# EAGLE schematic MainECU rev9 (EAGLE 9.5.0)

## Sheet 1 of 4: Inputs/Outputs and Power
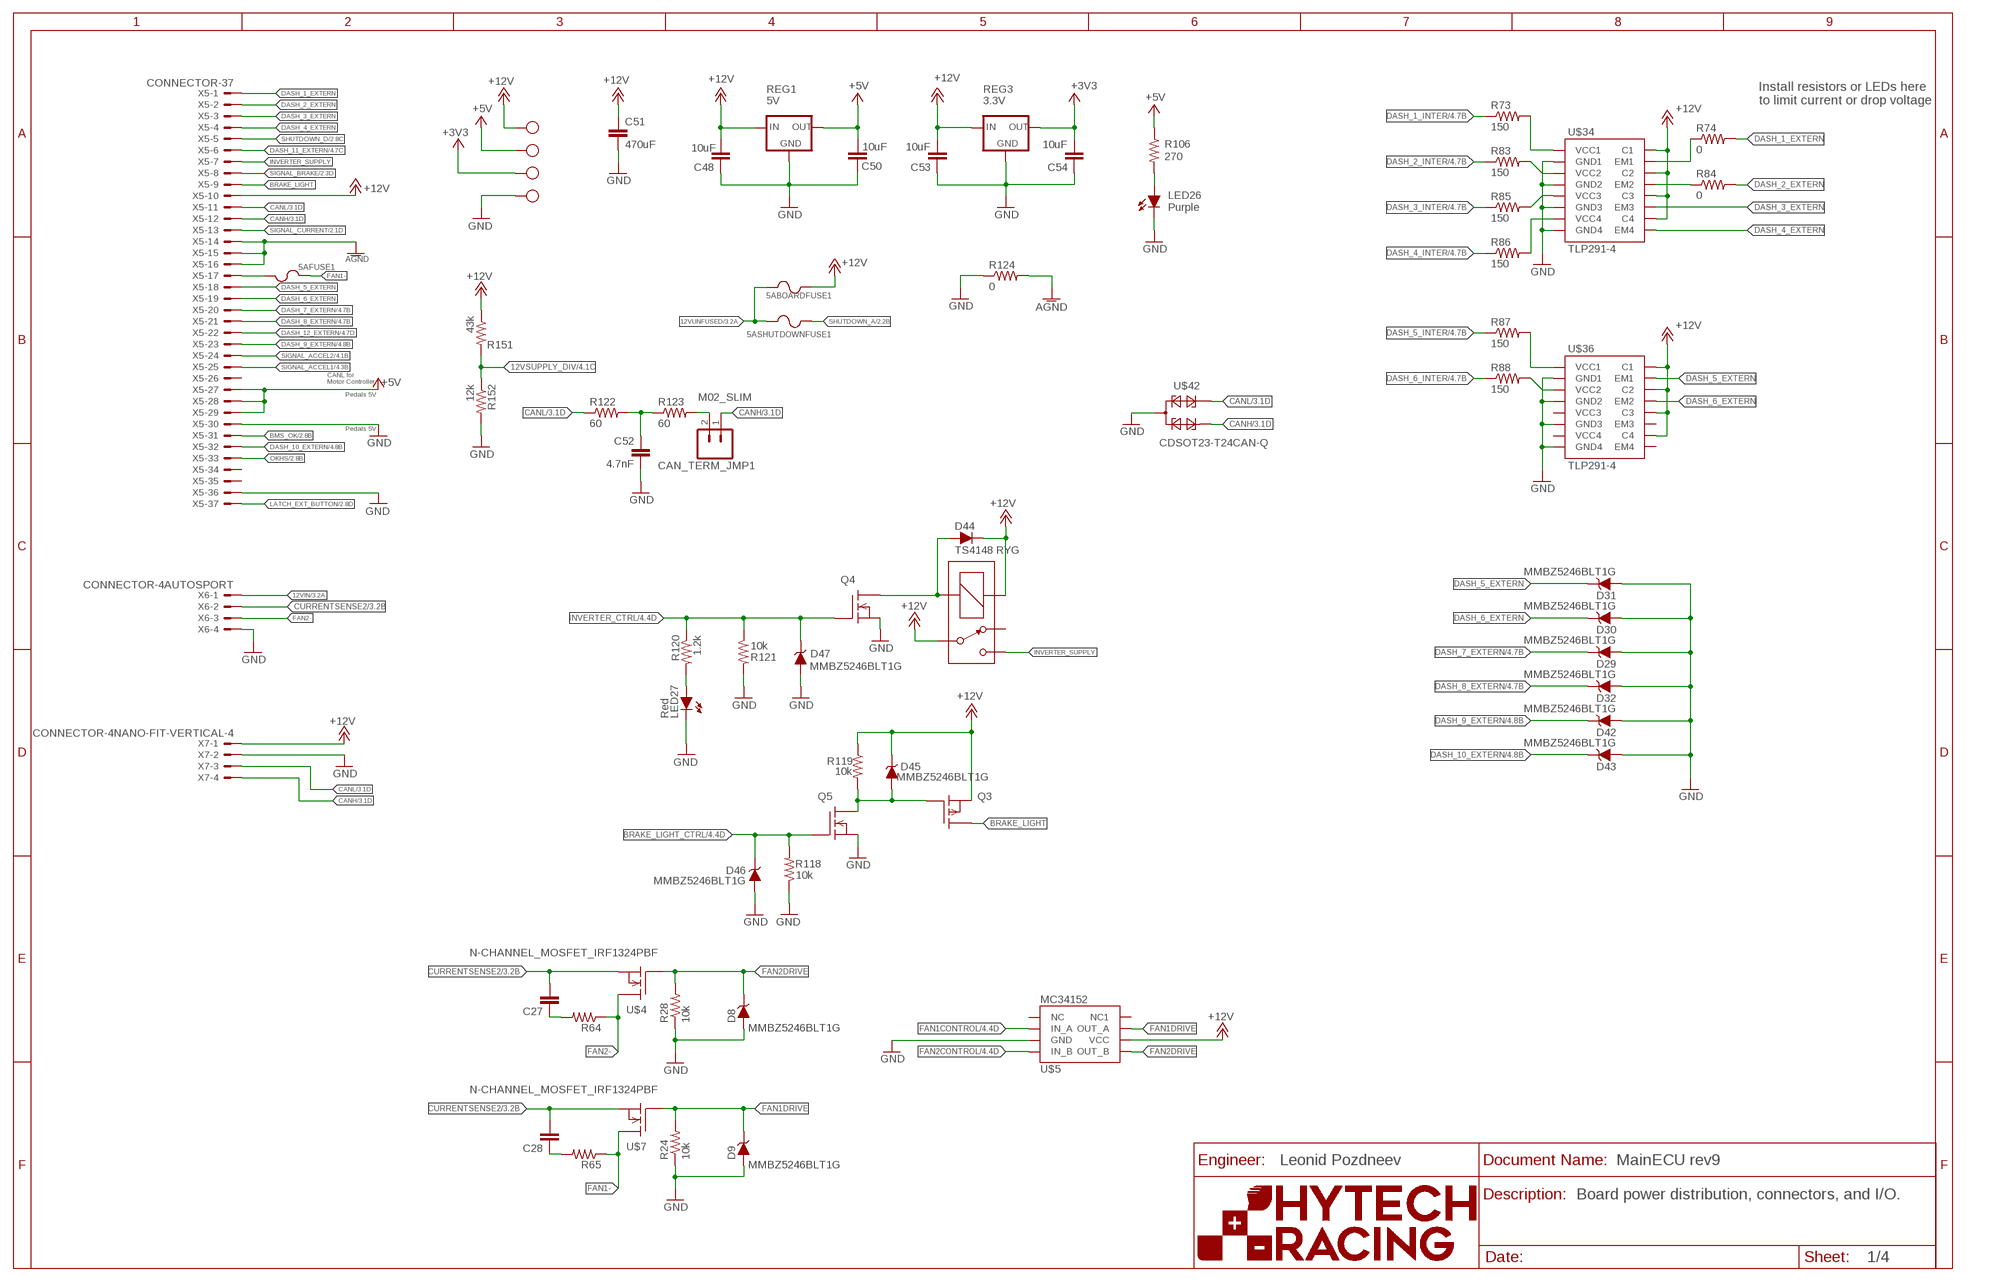
[diagram p0: schematic, sheet 1]
U$1 (FRAME_B_L): ORIENTATION: LANDSCAPE; SIZE: B

### Parts
3V3_TEST  TEST_POINT  [TEST_POINT]
5ABOARDFUSE1  FUSE_MINIBLADE  [MINI-BLADE_FUSE_HOLDER]
5AFUSE1  FUSE_MINIBLADE  [MINI-BLADE_FUSE_HOLDER]
5ASHUTDOWNFUSE1  FUSE_MINIBLADE  [MINI-BLADE_FUSE_HOLDER]
C  12V_TEST  TEST_POINT  [TEST_POINT]
C27  CAP0603-CAP  [0603-CAP]
C28  CAP0603-CAP  [0603-CAP]
C48  10uF  CAP0603-CAP  [0603-CAP]
C50  10uF  CAP0603-CAP  [0603-CAP]
C51  470uF  CAPPTH3  [CAP-PTH-LARGE]
C52  4.7nF  CAP0603-CAP  [0603-CAP]
C53  10uF  CAP0603-CAP  [0603-CAP]
C54  10uF  CAP0603-CAP  [0603-CAP]
CAN_TERM_JMP1  M02_SLIM  [1X02_SLIM]
D8  MMBZ5246BLT1G  DIODE_ZENER  [SOT23]
D9  MMBZ5246BLT1G  DIODE_ZENER  [SOT23]
D29  MMBZ5246BLT1G  DIODE_ZENER  [SOT23]
D30  MMBZ5246BLT1G  DIODE_ZENER  [SOT23]
D31  MMBZ5246BLT1G  DIODE_ZENER  [SOT23]
D32  MMBZ5246BLT1G  DIODE_ZENER  [SOT23]
D42  MMBZ5246BLT1G  DIODE_ZENER  [SOT23]
D43  MMBZ5246BLT1G  DIODE_ZENER  [SOT23]
D44  TS4148 RYG  DIODE0805  [0805_D]
D45  MMBZ5246BLT1G  DIODE_ZENER  [SOT23]
D46  MMBZ5246BLT1G  DIODE_ZENER  [SOT23]
D47  MMBZ5246BLT1G  DIODE_ZENER  [SOT23]
INVERTER_PWR_RELAY1  G5LE  [ZF112]
LED26  Purple  LED-0805  [LED-805]
LED27  Red  LED-0805  [LED-805]
Q3  P-CHANNEL_MOSFET_DMP3099L-7  [SOT23]
Q4  DMG3406LSOT  [SOT23]
Q5  DMG3406LSOT  [SOT23]
R24  10k  RESISTOR0603  [0603-RES]
R28  10k  RESISTOR0603  [0603-RES]
R64  RESISTOR0603  [0603-RES]
R65  RESISTOR0603  [0603-RES]
R73  150  RESISTOR0603  [0603-RES]
R74  0  RESISTOR0603  [0603-RES]
R83  150  RESISTOR0603  [0603-RES]
R84  0  RESISTOR0603  [0603-RES]
R85  150  RESISTOR0603  [0603-RES]
R86  150  RESISTOR0603  [0603-RES]
R87  150  RESISTOR0603  [0603-RES]
R88  150  RESISTOR0603  [0603-RES]
R106  270  RESISTOR0603  [0603-RES]
R118  10k  RESISTOR0603  [0603-RES]
R119  10k  RESISTOR0603  [0603-RES]
R120  1.2k  RESISTOR0603  [0603-RES]
R121  10k  RESISTOR0603  [0603-RES]
R122  60  RESISTOR0603  [0603-RES]
R123  60  RESISTOR0603  [0603-RES]
R124  0  RESISTOR0603  [0603-RES]
R151  43k  RESISTOR0603  [0603-RES]
R152  12k  RESISTOR0603  [0603-RES]
REG1  5V  OKI-78SR-5  [OKI-78SR]
REG3  3.3V  OKI-78SR-3.3  [OKI-78SR]
U$4  N-CHANNEL_MOSFET_IRF1324PBF  N-CHANNEL_MOSFET_HOR_HOLE  [TO-220-H-HOLE]
U$5  MC34152  [SOIC-08]
U$7  N-CHANNEL_MOSFET_IRF1324PBF  N-CHANNEL_MOSFET_HOR_HOLE  [TO-220-H-HOLE]
U$15  TEST_POINT  [TEST_POINT]
U$19  TEST_POINT  [TEST_POINT]
U$34  TLP291-4  [11-11F1]
U$36  TLP291-4  [11-11F1]
U$42  CDSOT23-T24CAN-Q  [SOT23]
X5  CONNECTOR-37  [AUTOSPORT_14-35]
X6  CONNECTOR-4AUTOSPORT  [AUTOSPORT_12-04]
X7  CONNECTOR-4NANO-FIT-VERTICAL-4  [NANO-FIT_VERTICAL-4]

### Nets
12VIN: X6.P$1 ; also sheet 3
12VSUPPLY_DIV: R151.2 R152.1 ; also sheet 4
12VUNFUSED: 5ABOARDFUSE1.L1 5ABOARDFUSE1.L2 5ASHUTDOWNFUSE1.L1 5ASHUTDOWNFUSE1.L2 ; also sheet 3
+3V3: 3V3_TEST.P$1 C54.2 REG3.3(OUT) ; also sheet 3,4
+5V: C50.2 R106.1 REG1.3(OUT) U$15.P$1 X5.P$27 X5.P$28 X5.P$29 ; also sheet 2,3,4
+12V: 5ABOARDFUSE1.R1 5ABOARDFUSE1.R2 C48.2 C51.1 C53.2 C.P$1 D44.C D45.3(C) INVERTER_PWR_RELAY1.1(COIL+) INVERTER_PWR_RELAY1.P Q3.2(S) R119.1 R151.1 REG1.1(IN) REG3.1(IN) U$5.6(VCC) U$34.10(C4) U$34.12(C3) U$34.14(C2) U$34.16(C1) U$36.10(C4) U$36.12(C3) U$36.14(C2) U$36.16(C1) X5.P$10 X7.P$1 ; also sheet 2
AGND: R124.2 X5.P$14 X5.P$15 X5.P$16 ; also sheet 3,4
BMS_OK: X5.P$31 ; also sheet 2,4
BRAKE_LIGHT: Q3.3(D) X5.P$9
BRAKE_LIGHT_CTRL: D46.3(C) Q5.1(G) R118.2 ; also sheet 4
CANH: CAN_TERM_JMP1.1 U$42.2 X5.P$12 X7.P$4 ; also sheet 3,4
CANL: R122.1 U$42.1 X5.P$11 X7.P$3 ; also sheet 3,4
CURRENTSENSE2: C27.2 C28.2 U$4.3(S) U$7.3(S) X6.P$2 ; also sheet 3
DASH_1_EXTERN: R74.2 X5.P$1
DASH_1_INTER: R73.1 ; also sheet 4
DASH_2_EXTERN: R84.2 X5.P$2
DASH_2_INTER: R83.1 ; also sheet 4
DASH_3_EXTERN: U$34.11(EM3) X5.P$3
DASH_3_INTER: R85.1 ; also sheet 4
DASH_4_EXTERN: U$34.9(EM4) X5.P$4
DASH_4_INTER: R86.1 ; also sheet 4
DASH_5_EXTERN: D31.3(C) U$36.15(EM1) X5.P$18
DASH_5_INTER: R87.1 ; also sheet 4
DASH_6_EXTERN: D30.3(C) U$36.13(EM2) X5.P$19
DASH_6_INTER: R88.1 ; also sheet 4
DASH_7_EXTERN: D29.3(C) X5.P$20 ; also sheet 4
DASH_8_EXTERN: D32.3(C) X5.P$21 ; also sheet 4
DASH_9_EXTERN: D42.3(C) X5.P$23 ; also sheet 4
DASH_10_EXTERN: D43.3(C) X5.P$32 ; also sheet 4
DASH_11_EXTERN: X5.P$6 ; also sheet 4
DASH_12_EXTERN: X5.P$22 ; also sheet 4
FAN1-: 5AFUSE1.R1 5AFUSE1.R2 R65.1 U$7.2(D)
FAN1CONTROL: U$5.2(IN_A) ; also sheet 4
FAN1DRIVE: D9.3(C) R24.2 U$5.7(OUT_A) U$7.1(G)
FAN2-: R64.1 U$4.2(D) X6.P$3
FAN2CONTROL: U$5.4(IN_B) ; also sheet 4
FAN2DRIVE: D8.3(C) R28.2 U$4.1(G) U$5.5(OUT_B)
GND: C48.1 C50.1 C51.2 C52.2 C53.1 C54.1 D8.1(A) D9.1(A) D29.1(A) D30.1(A) D31.1(A) D32.1(A) D42.1(A) D43.1(A) D46.1(A) D47.1(A) LED26.C LED27.C Q4.2(S) Q5.2(S) R24.1 R28.1 R118.1 R121.2 R124.1 R152.2 REG1.2(GND) REG3.2(GND) U$5.3(GND) U$19.P$1 U$34.2(GND1) U$34.4(GND2) U$34.6(GND3) U$34.8(GND4) U$36.2(GND1) U$36.4(GND2) U$36.6(GND3) U$36.8(GND4) U$42.3 X5.P$30 X5.P$36 X6.P$4 X7.P$2 ; also sheet 2,3,4
INVERTER_CTRL: D47.3(C) Q4.1(G) R120.1 R121.1 ; also sheet 4
INVERTER_SUPPLY: INVERTER_PWR_RELAY1.S X5.P$7
LATCH_EXT_BUTTON: X5.P$37 ; also sheet 2
N$65: C27.1 R64.2
N$70: 5AFUSE1.L1 5AFUSE1.L2 X5.P$17
N$74: C28.1 R65.2
N$84: R73.2 U$34.1(VCC1)
N$87: R74.1 U$34.15(EM1)
N$89: R83.2 U$34.3(VCC2)
N$90: R84.1 U$34.13(EM2)
N$91: R85.2 U$34.5(VCC3)
N$92: R86.2 U$34.7(VCC4)
N$93: R87.2 U$36.1(VCC1)
N$94: R88.2 U$36.3(VCC2)
N$113: LED26.A R106.2
N$114: D45.1(A) Q3.1(G) Q5.3(D) R119.2
N$116: LED27.A R120.2
N$117: D44.A INVERTER_PWR_RELAY1.2(COIL-) Q4.3(D)
N$118: CAN_TERM_JMP1.2 R123.2
N$119: C52.1 R122.2 R123.1
OKHS: X5.P$33 ; also sheet 2,4
SHUTDOWN_A: 5ASHUTDOWNFUSE1.R1 5ASHUTDOWNFUSE1.R2 ; also sheet 2
SHUTDOWN_D: X5.P$5 ; also sheet 2,4
SIGNAL_ACCEL1: X5.P$25 ; also sheet 4
SIGNAL_ACCEL2: X5.P$24 ; also sheet 4
SIGNAL_BRAKE: X5.P$8 ; also sheet 2,4
SIGNAL_CURRENT: X5.P$13 ; also sheet 2
Unconnected: INVERTER_PWR_RELAY1.O U$5.1(NC) U$5.8(NC1) U$36.5(VCC3) U$36.7(VCC4) U$36.9(EM4) U$36.11(EM3) X5.P$26 X5.P$34 X5.P$35

### Notes on the sheet
- Install resistors or LEDs here
  to limit current or drop voltage
- CANL for
  Motor Controller
- Pedals 5V
- Pedals 5V
- Leonid Pozdneev
- Board power distribution, connectors, and I/O.

## Sheet 2 of 4: Shutdown Circuitry
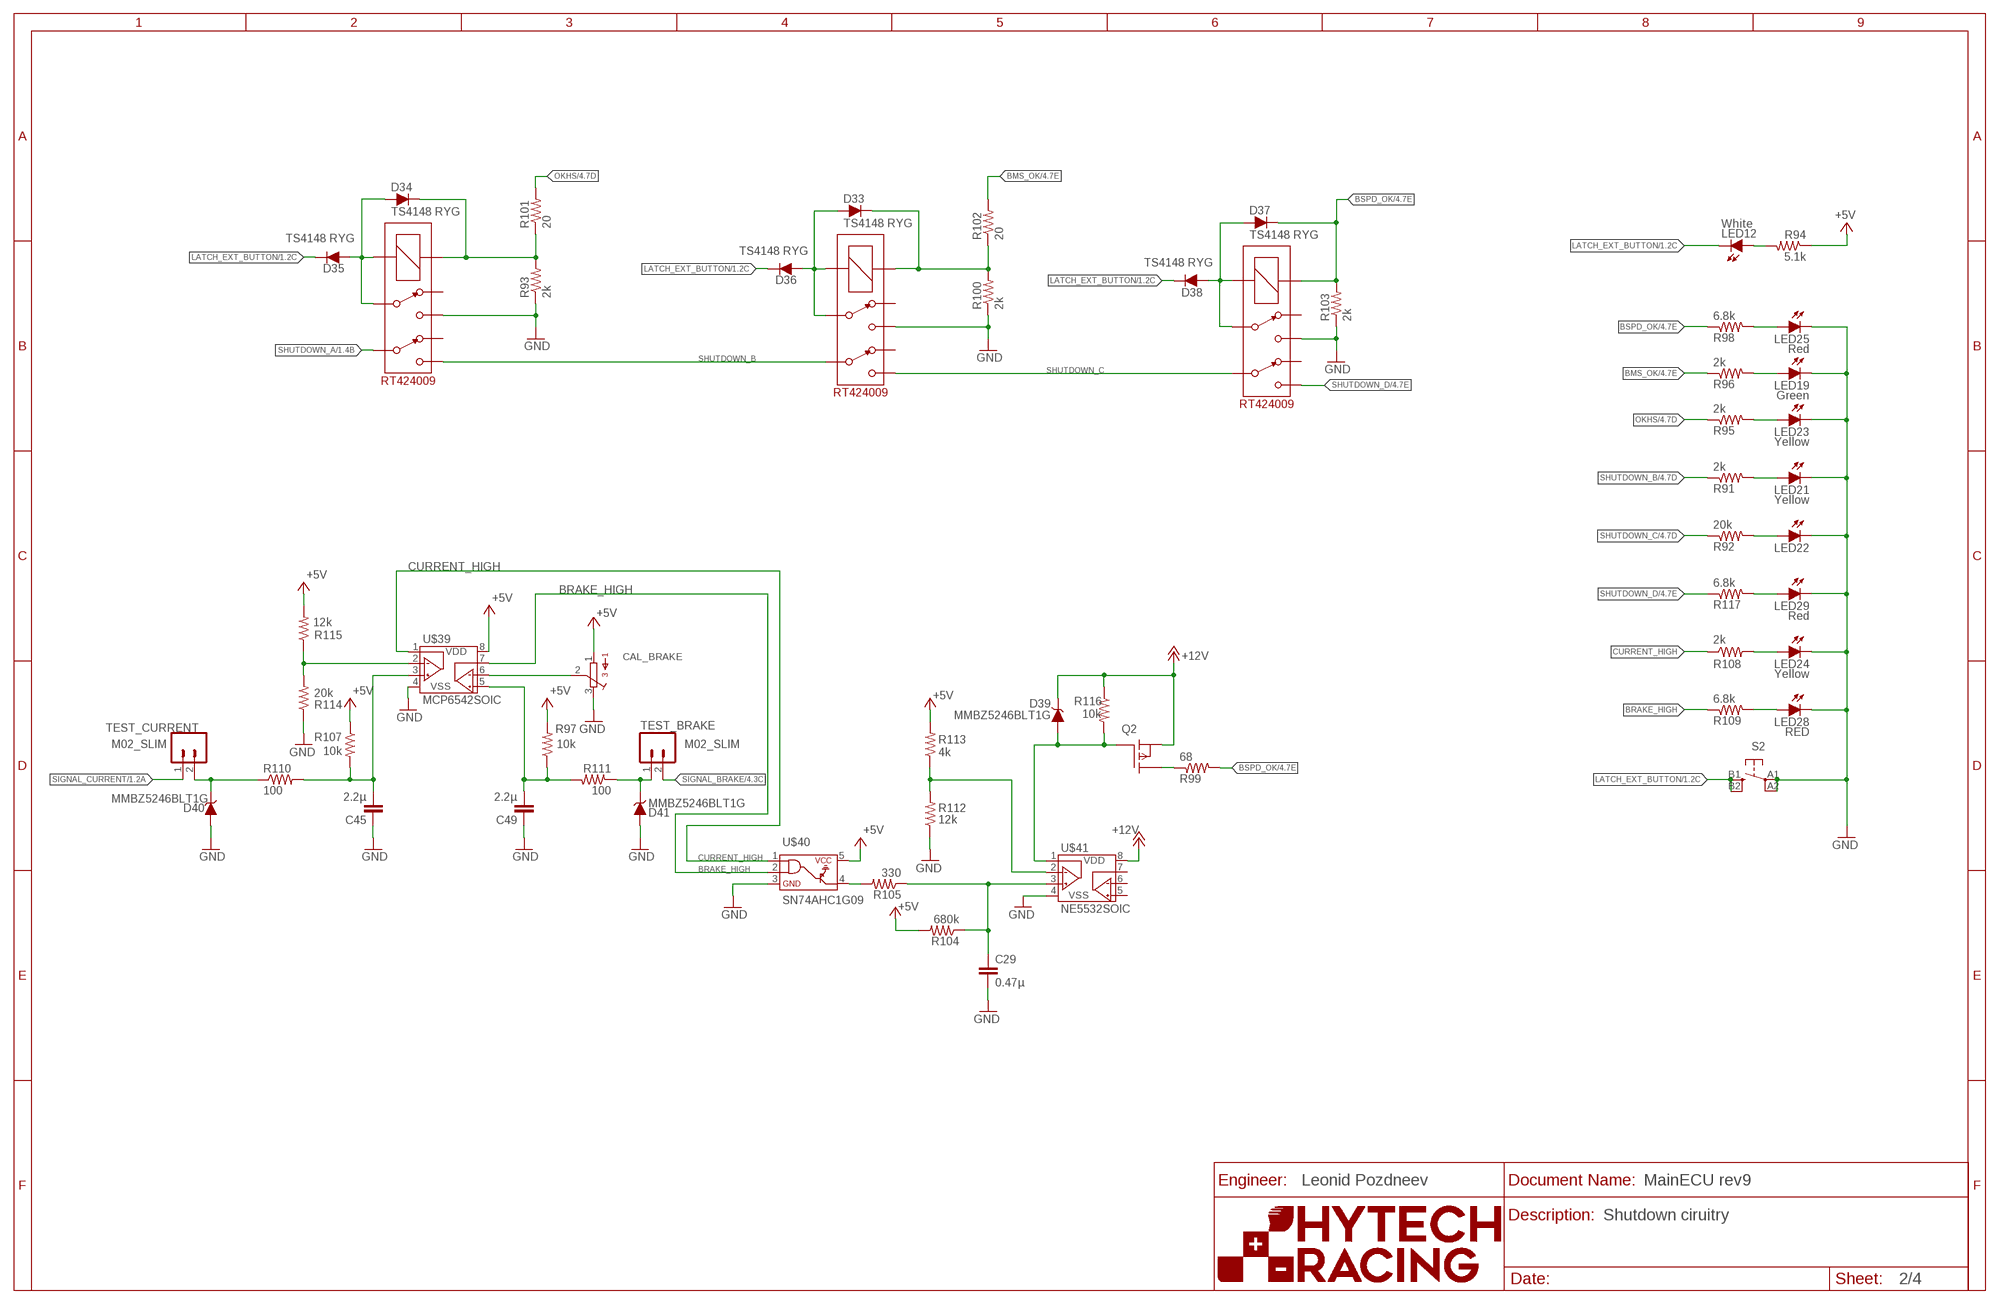
[diagram p1: schematic, sheet 2]
U$2 (FRAME_B_L): ORIENTATION: LANDSCAPE; SIZE: B

### Parts
C29  0.47µ  CAP0603-CAP  [0603-CAP]
C45  2.2µ  CAP0603-CAP  [0603-CAP]
C49  2.2µ  CAP0603-CAP  [0603-CAP]
CAL_BRAKE  TRIMPOT_3296C  [TRIMPOT_3296]
D33  TS4148 RYG  DIODE0805  [0805_D]
D34  TS4148 RYG  DIODE0805  [0805_D]
D35  TS4148 RYG  DIODE0805  [0805_D]
D36  TS4148 RYG  DIODE0805  [0805_D]
D37  TS4148 RYG  DIODE0805  [0805_D]
D38  TS4148 RYG  DIODE0805  [0805_D]
D39  MMBZ5246BLT1G  DIODE_ZENER  [SOT23]
D40  MMBZ5246BLT1G  DIODE_ZENER  [SOT23]
D41  MMBZ5246BLT1G  DIODE_ZENER  [SOT23]
IMD_SHUTDOWN_RLY1  RT424009  [RELAY_DPDT]
LED12  White  LED-0805  [LED-805]
LED19  Green  LED-0805  [LED-805]
LED21  Yellow  LED-0805  [LED-805]
LED22  Green  LED-0805  [LED-805]
LED23  Yellow  LED-0805  [LED-805]
LED24  Yellow  LED-0805  [LED-805]
LED25  Red  LED-0805  [LED-805]
LED28  RED  LED-0805  [LED-805]
LED29  Red  LED-0805  [LED-805]
Q2  P-CHANNEL_MOSFET_DMP3099L-7  [SOT23]
R91  2k  RESISTOR0603  [0603-RES]
R92  20k  RESISTOR0603  [0603-RES]
R93  2k  RESISTOR0603  [0603-RES]
R94  5.1k  RESISTOR0603  [0603-RES]
R95  2k  RESISTOR0603  [0603-RES]
R96  2k  RESISTOR0603  [0603-RES]
R97  10k  RESISTOR0603  [0603-RES]
R98  6.8k  RESISTOR0603  [0603-RES]
R99  68  RESISTOR0603  [0603-RES]
R100  2k  RESISTOR0603  [0603-RES]
R101  20  RESISTOR0603  [0603-RES]
R102  20  RESISTOR0603  [0603-RES]
R103  2k  RESISTOR0603  [0603-RES]
R104  680k  RESISTOR0603  [0603-RES]
R105  330  RESISTOR0603  [0603-RES]
R107  10k  RESISTOR0603  [0603-RES]
R108  2k  RESISTOR0603  [0603-RES]
R109  6.8k  RESISTOR0603  [0603-RES]
R110  100  RESISTOR0603  [0603-RES]
R111  100  RESISTOR0603  [0603-RES]
R112  12k  RESISTOR0603  [0603-RES]
R113  4k  RESISTOR0603  [0603-RES]
R114  20k  RESISTOR0603  [0603-RES]
R115  12k  RESISTOR0603  [0603-RES]
R116  10k  RESISTOR0603  [0603-RES]
R117  6.8k  RESISTOR0603  [0603-RES]
S2  BTN_10-XXSMD  [TACTILE_SWITCH_SMD_6.2MM_TALL]
TEST_BRAKE  M02_SLIM  [1X02_SLIM]
TEST_CURRENT  M02_SLIM  [1X02_SLIM]
U$37  RT424009  [RELAY_DPDT]
U$38  RT424009  [RELAY_DPDT]
U$39  MCP6542SOIC  [SOIC-08]
U$40  SN74AHC1G09  [SOT-23-5]
U$41  NE5532SOIC  [SOIC-08]

### Nets
+5V: CAL_BRAKE.1 R94.1 R97.2 R104.2 R107.1 R113.2 R115.2 U$39.8(VDD) U$40.5 ; also sheet 1,3,4
+12V: D39.3(C) Q2.2(S) R116.1 U$41.8(VDD) ; also sheet 1
BMS_OK: R96.1 R102.2 ; also sheet 1,4
BMS_PWR_STEP1: D33.A D36.A U$38.3 U$38.COIL-
BRAKE_HIGH: R109.1 U$39.7(VOUTB) U$40.2
BSPD_OK: D37.C R98.1 R99.2 R103.2 U$37.COIL+ ; also sheet 4
CURRENT_HIGH: R108.1 U$39.1(VOUTA) U$40.1
GND: C29.2 C45.1 C49.1 CAL_BRAKE.3 D40.1(A) D41.1(A) IMD_SHUTDOWN_RLY1.4 LED19.C LED21.C LED22.C LED23.C LED24.C LED25.C LED28.C LED29.C R93.1 R100.1 R103.1 R112.1 R114.1 S2.A1(P) S2.A2(P1) U$37.4 U$38.4 U$39.4(VSS) U$40.3 U$41.4(VSS) ; also sheet 1,3,4
IMD_PWR_STEP1: D34.A D35.A IMD_SHUTDOWN_RLY1.3 IMD_SHUTDOWN_RLY1.COIL-
LATCH_EXT_BUTTON: D35.C D36.C D38.C LED12.C S2.B1(S) S2.B2(S1) ; also sheet 1
N$1: Q2.3(D) R99.1
N$3: D34.C IMD_SHUTDOWN_RLY1.COIL+ R93.2 R101.1
N$4: D33.C R100.2 R102.1 U$38.COIL+
N$5: D40.3(C) R110.1 TEST_CURRENT.2
N$6: D41.3(C) R111.1 TEST_BRAKE.1
N$97: LED21.A R91.2
N$98: LED22.A R92.2
N$99: LED12.A R94.2
N$100: LED23.A R95.2
N$101: LED19.A R96.2
N$102: LED24.A R108.2
N$103: LED28.A R109.2
N$104: R114.2 R115.1 U$39.2(VINA-)
N$105: D37.A D38.A U$37.3 U$37.COIL-
N$106: C45.2 R107.2 R110.2 U$39.3(VINA+)
N$107: R105.2 U$40.4
N$108: LED25.A R98.2
N$109: C29.1 R104.1 R105.1 U$41.3(VINA+)
N$110: R112.2 R113.1 U$41.2(VINA-)
N$111: CAL_BRAKE.2 U$39.6(VINB-)
N$112: D39.1(A) Q2.1(G) R116.2 U$41.1(VOUTA)
N$115: LED29.A R117.2
OKHS: R95.1 R101.2 ; also sheet 1,4
SHUTDOWN_A: IMD_SHUTDOWN_RLY1.6 ; also sheet 1
SHUTDOWN_B: IMD_SHUTDOWN_RLY1.5 R91.1 U$38.6 ; also sheet 4
SHUTDOWN_C: R92.1 U$37.6 U$38.5 ; also sheet 4
SHUTDOWN_D: R117.1 U$37.5 ; also sheet 1,4
SIGNAL_BRAKE: TEST_BRAKE.2 ; also sheet 1,4
SIGNAL_BRAKE_FILT1: C49.2 R97.1 R111.2 U$39.5(VINB+)
SIGNAL_CURRENT: TEST_CURRENT.1 ; also sheet 1
Unconnected: IMD_SHUTDOWN_RLY1.2 IMD_SHUTDOWN_RLY1.7 U$37.2 U$37.7 U$38.2 U$38.7 U$41.5(VINB+) U$41.6(VINB-) U$41.7(VOUTB)

### Notes on the sheet
- Leonid Pozdneev
- Shutdown ciruitry

## Sheet 3 of 4: Telemetry
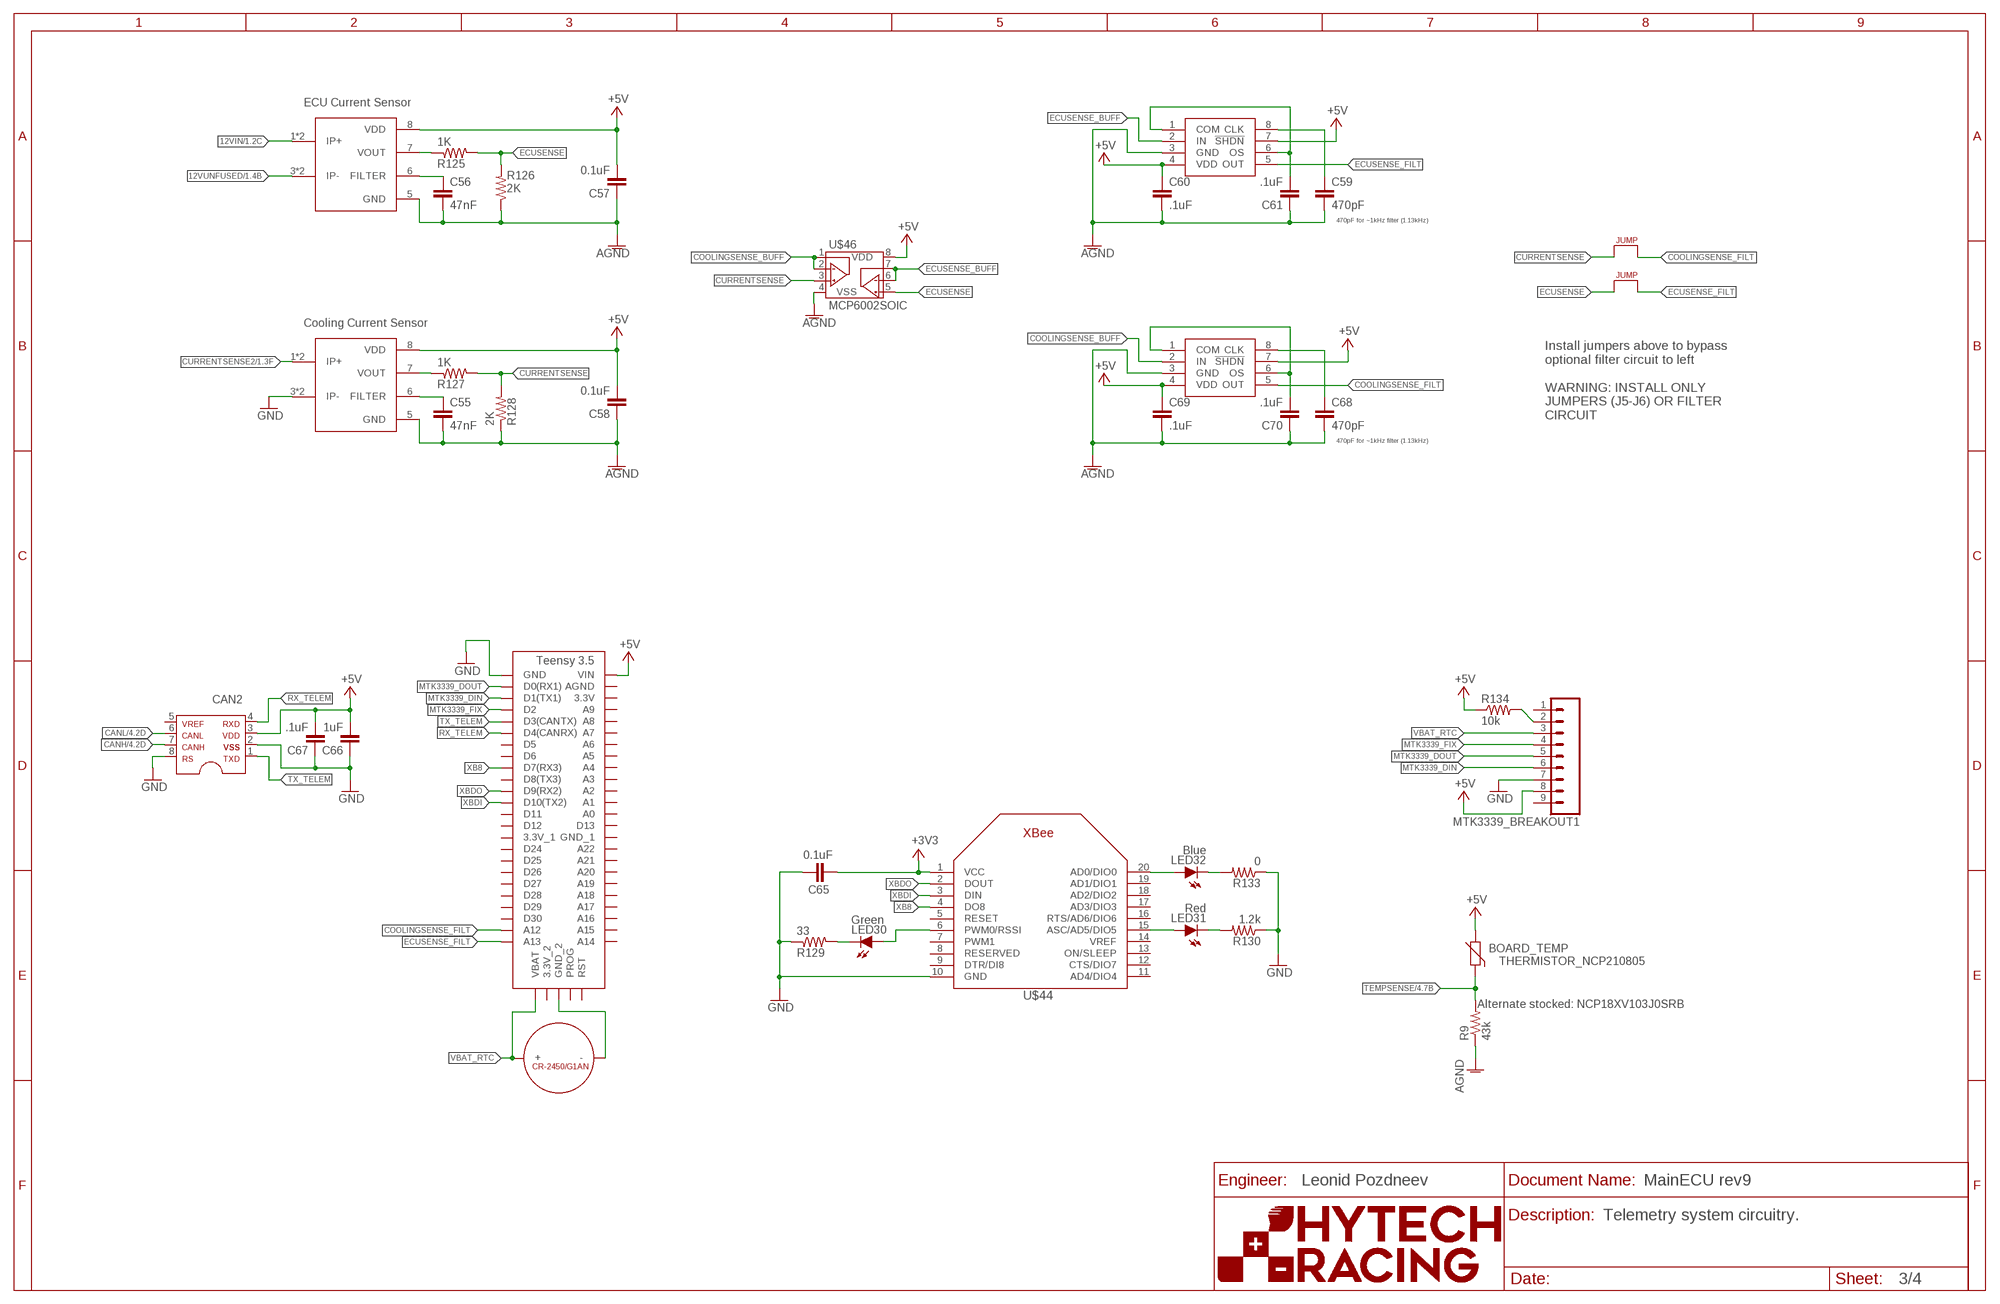
[diagram p2: schematic, sheet 3]
U$3 (FRAME_B_L): ORIENTATION: LANDSCAPE; SIZE: B

### Parts
BOARD_TEMP  THERMISTOR_NCP210805  [0805]
C55  47nF  CAP0603-CAP  [0603-CAP]
C56  47nF  CAP0603-CAP  [0603-CAP]
C57  0.1uF  CAP0603-CAP  [0603-CAP]
C58  0.1uF  CAP0603-CAP  [0603-CAP]
C59  470pF  CAP0603-CAP  [0603-CAP]
C60  .1uF  CAP0603-CAP  [0603-CAP]
C61  .1uF  CAP0603-CAP  [0603-CAP]
C65  0.1uF  CAP0603-CAP  [0603-CAP]
C66  1uF  CAP0603-CAP  [0603-CAP]
C67  .1uF  CAP0603-CAP  [0603-CAP]
C68  470pF  CAP0603-CAP  [0603-CAP]
C69  .1uF  CAP0603-CAP  [0603-CAP]
C70  .1uF  CAP0603-CAP  [0603-CAP]
CAN2  MCP2551  [SOIC-08]
J15  JUMPER  [0805]
J16  JUMPER  [0805]
LED30  Green  LED-0805  [LED-805]
LED31  Red  LED-0805  [LED-805]
LED32  Blue  LED-0805  [LED-805]
MTK3339_BREAKOUT1  M09  [1X09]
R9  43k  RESISTOR0603  [0603-RES]
R125  1K  RESISTOR0603  [0603-RES]
R126  2K  RESISTOR0603  [0603-RES]
R127  1K  RESISTOR0603  [0603-RES]
R128  2K  RESISTOR0603  [0603-RES]
R129  33  RESISTOR0603  [0603-RES]
R130  1.2k  RESISTOR0603  [0603-RES]
R133  0  RESISTOR0603  [0603-RES]
R134  10k  RESISTOR0603  [0603-RES]
U$43  TEENSY_3.5_EXT  [TEENSY_3.5_EXT]
U$44  XBEE  [XBEE]
U$45  CR-2450/G1AN  [CR-2450/G1AN]
U$46  MCP6002SOIC  [SOIC-08]
U$47  MAX7480  [SOIC-08]
U$49  ACHS-7121  [SOP8]
U$50  ACHS-7121  [SOP8]
U$51  MAX7480  [SOIC-08]

### Nets
12VIN: U$49.1(IP+) U$49.2(IP+) ; also sheet 1
12VUNFUSED: U$49.3(IP-) U$49.4(IP-) ; also sheet 1
+3V3: C65.1 U$44.1(VCC) ; also sheet 1,4
+5V: BOARD_TEMP.1 C57.2 C58.2 C60.1 C66.2 C67.2 C69.1 CAN2.3 MTK3339_BREAKOUT1.8 R134.1 U$43.VIN U$46.8(VDD) U$47.4(VDD) U$47.7(!SHDN) U$49.8(VDD) U$50.8(VDD) U$51.4(VDD) U$51.7(!SHDN) ; also sheet 1,2,4
AGND: C55.2 C56.2 C57.1 C58.1 C59.2 C60.2 C61.1 C68.2 C69.2 C70.1 R9.1 R126.1 R128.1 U$46.4(VSS) U$47.3(GND) U$49.5(GND) U$50.5(GND) U$51.3(GND) ; also sheet 1,4
CANH: CAN2.7 ; also sheet 1,4
CANL: CAN2.6 ; also sheet 1,4
COOLINGSENSE_BUFF: U$46.1(VOUTA) U$46.2(VINA-) U$51.2(IN)
COOLINGSENSE_FILT: J15.1 U$43.A12 U$51.5(OUT)
CURRENTSENSE: J15.2 R127.2 R128.2 U$46.3(VINA+)
CURRENTSENSE2: U$50.1(IP+) U$50.2(IP+) ; also sheet 1
ECUSENSE: J16.2 R125.2 R126.2 U$46.5(VINB+)
ECUSENSE_BUFF: U$46.6(VINB-) U$46.7(VOUTB) U$47.2(IN)
ECUSENSE_FILT: J16.1 U$43.A13 U$47.5(OUT)
GND: C65.2 C66.1 C67.1 CAN2.2 CAN2.8 MTK3339_BREAKOUT1.7 R129.1 R130.1 R133.1 U$43.GND U$44.10(GND) U$50.3(IP-) U$50.4(IP-) ; also sheet 1,2,4
MTK3339_DIN: MTK3339_BREAKOUT1.6 U$43.D1(TX1)
MTK3339_DOUT: MTK3339_BREAKOUT1.5 U$43.D0(RX1)
MTK3339_FIX: MTK3339_BREAKOUT1.4 U$43.D2
N$122: C55.1 U$50.6(FILTER)
N$123: C56.1 U$49.6(FILTER)
N$126: LED30.C R129.2
N$127: LED30.A U$44.6(PWM0/RSSI)
N$128: LED31.A U$44.15(ASC/AD5/DIO5)
N$129: LED31.C R130.2
N$130: LED32.C R133.2
N$131: LED32.A U$44.20(AD0/DIO0)
N$132: U$43.GND_2 U$45.-
N$134: C68.1 U$51.8(CLK)
N$136: C59.1 U$47.8(CLK)
N$139: MTK3339_BREAKOUT1.2 R134.2
N$140: R125.1 U$49.7(VOUT)
N$141: R127.1 U$50.7(VOUT)
N$142: C61.2 U$47.1(COM) U$47.6(OS)
N$143: C70.2 U$51.1(COM) U$51.6(OS)
RX_TELEM: CAN2.4 U$43.D4(CANRX)
TEMPSENSE: BOARD_TEMP.2 R9.2 ; also sheet 4
TX_TELEM: CAN2.1 U$43.D3(CANTX)
VBAT_RTC: MTK3339_BREAKOUT1.3 U$43.VBAT U$45.+_0(+) U$45.+_1(+)
XB8: U$43.D7(RX3) U$44.4(DO8)
XBDI: U$43.D10(TX2) U$44.3(DIN)
XBDO: U$43.D9(RX2) U$44.2(DOUT)
Unconnected: CAN2.5 MTK3339_BREAKOUT1.1 MTK3339_BREAKOUT1.9 U$43.3.3V U$43.3.3V_1 U$43.3.3V_2 U$43.A0 U$43.A1 U$43.A2 U$43.A3 U$43.A4 U$43.A5 U$43.A6 U$43.A7 U$43.A8 U$43.A9 U$43.A14 U$43.A15 U$43.A16 U$43.A17 U$43.A18 U$43.A19 U$43.A20 U$43.A21 U$43.A22 U$43.AGND U$43.D5 U$43.D6 U$43.D8(TX3) U$43.D11 U$43.D12 U$43.D13 U$43.D24 U$43.D25 U$43.D26 U$43.D27 U$43.D28 U$43.D29 U$43.D30 U$43.GND_1 U$43.PROG U$43.RST U$44.5(RESET) U$44.7(PWM1) U$44.8(RESERVED) U$44.9(DTR/DI8) U$44.11(AD4/DIO4) U$44.12(CTS/DIO7) U$44.13(ON/SLEEP) U$44.14(VREF) U$44.16(RTS/AD6/DIO6) U$44.17(AD3/DIO3) U$44.18(AD2/DIO2) U$44.19(AD1/DIO1)

### Notes on the sheet
- ECU Current Sensor
- 470pF for ~1kHz filter (1.13kHz)
- Cooling Current Sensor
- Install jumpers above to bypass
  optional filter circuit to left
  
  WARNING: INSTALL ONLY
  JUMPERS (J5-J6) OR FILTER
  CIRCUIT
- 470pF for ~1kHz filter (1.13kHz)
- Alternate stocked: NCP18XV103J0SRB
- Leonid Pozdneev
- Telemetry system circuitry.

## Sheet 4 of 4: Analog Circuitry/Main Teensy
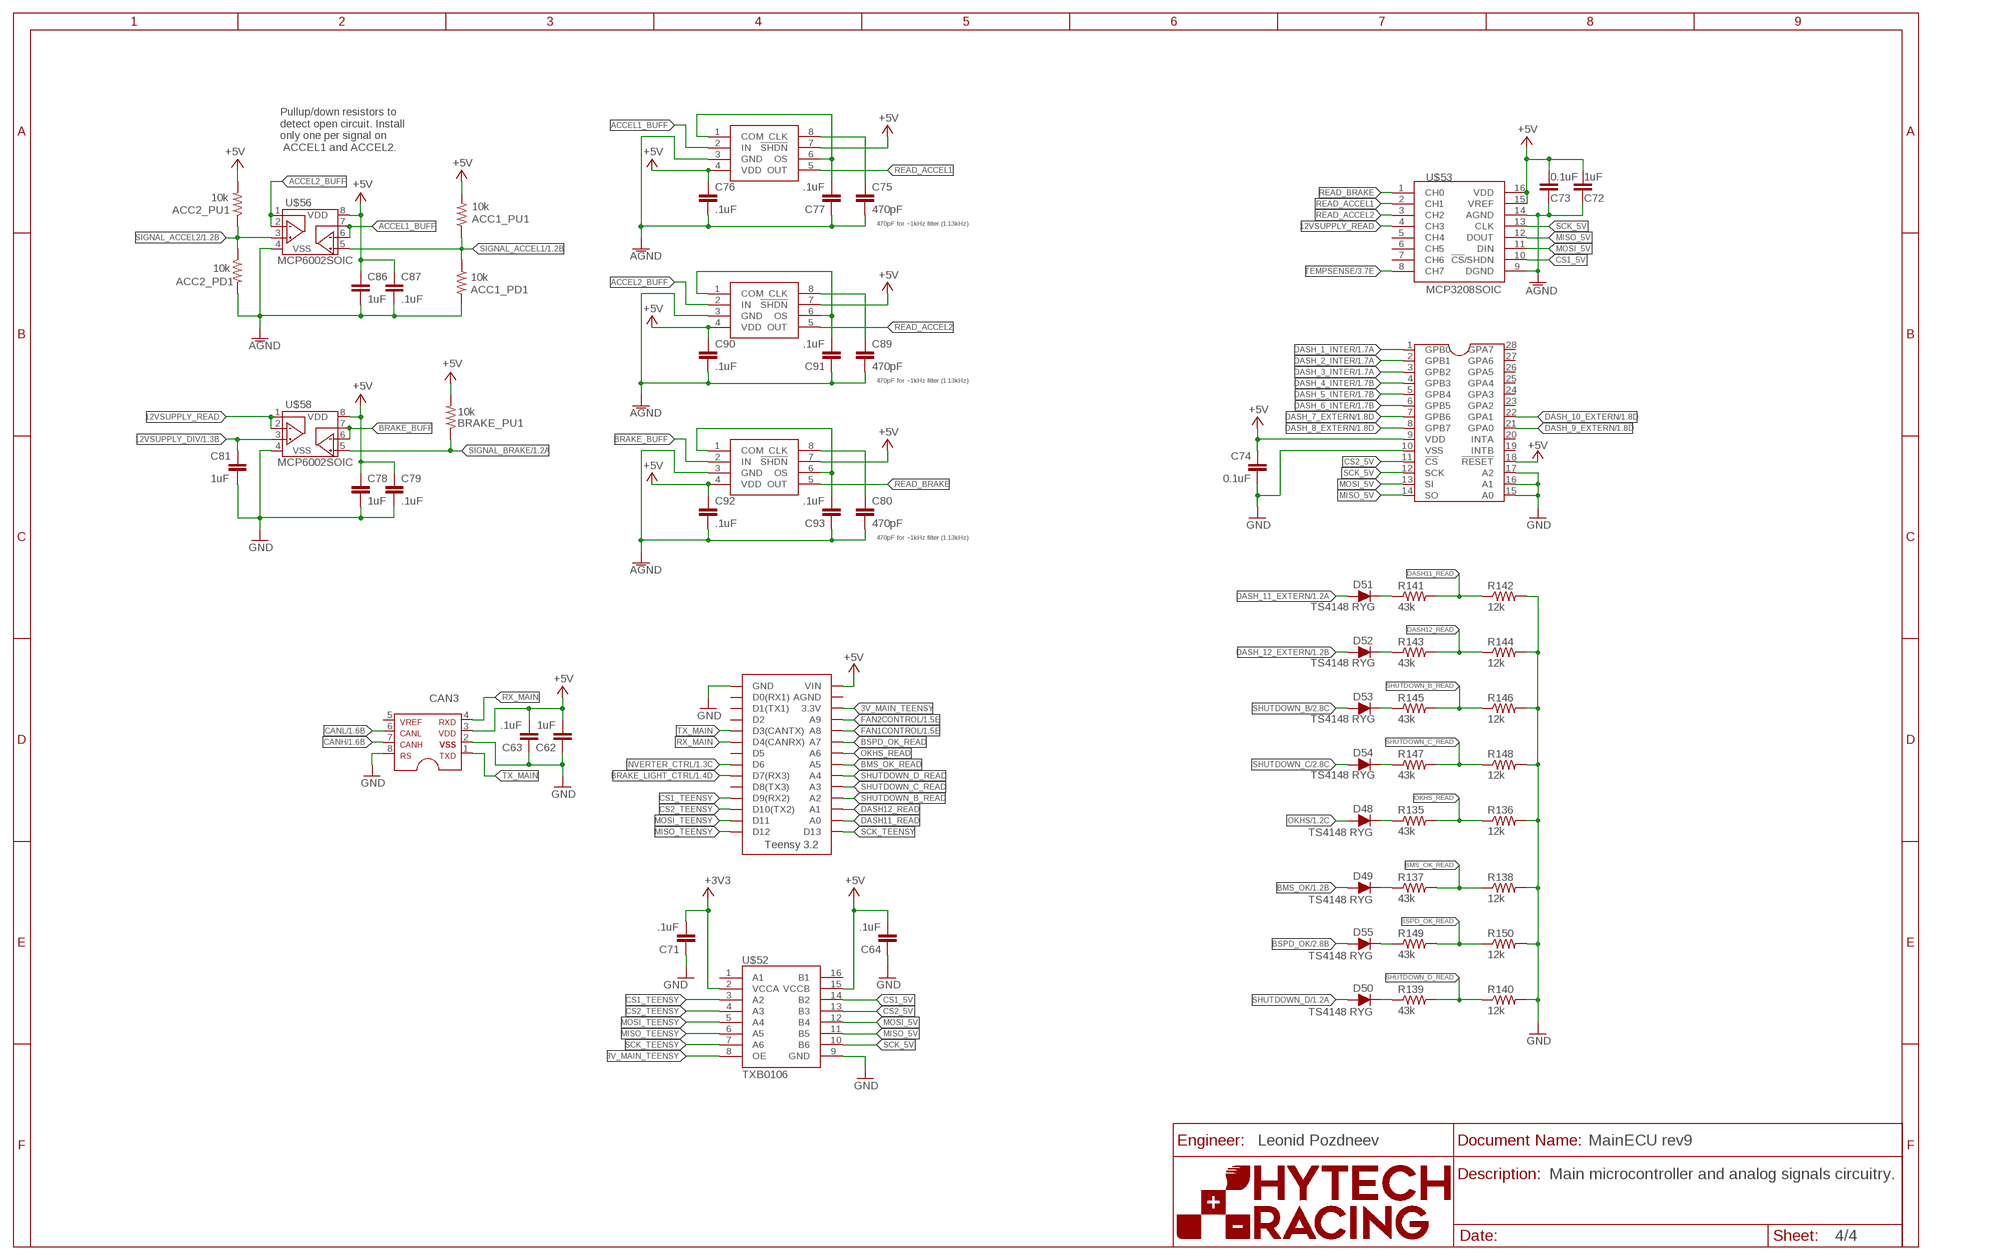
[diagram p3: schematic, sheet 4]
U$6 (FRAME_B_L): ORIENTATION: LANDSCAPE; SIZE: B

### Parts
ACC1_PD1  10k  RESISTOR0603-RES  [0603-RES]
ACC1_PU1  10k  RESISTOR0603-RES  [0603-RES]
ACC2_PD1  10k  RESISTOR0603-RES  [0603-RES]
ACC2_PU1  10k  RESISTOR0603-RES  [0603-RES]
BRAKE_PU1  10k  RESISTOR0603-RES  [0603-RES]
C62  1uF  CAP0603-CAP  [0603-CAP]
C63  .1uF  CAP0603-CAP  [0603-CAP]
C64  .1uF  CAP0603-CAP  [0603-CAP]
C71  .1uF  CAP0603-CAP  [0603-CAP]
C72  1uF  CAP0603-CAP  [0603-CAP]
C73  0.1uF  CAP0603-CAP  [0603-CAP]
C74  0.1uF  CAP0603-CAP  [0603-CAP]
C75  470pF  CAP0603-CAP  [0603-CAP]
C76  .1uF  CAP0603-CAP  [0603-CAP]
C77  .1uF  CAP0603-CAP  [0603-CAP]
C78  1uF  CAP0603-CAP  [0603-CAP]
C79  .1uF  CAP0603-CAP  [0603-CAP]
C80  470pF  CAP0603-CAP  [0603-CAP]
C81  1uF  CAP0603-CAP  [0603-CAP]
C86  1uF  CAP0603-CAP  [0603-CAP]
C87  .1uF  CAP0603-CAP  [0603-CAP]
C89  470pF  CAP0603-CAP  [0603-CAP]
C90  .1uF  CAP0603-CAP  [0603-CAP]
C91  .1uF  CAP0603-CAP  [0603-CAP]
C92  .1uF  CAP0603-CAP  [0603-CAP]
C93  .1uF  CAP0603-CAP  [0603-CAP]
CAN3  MCP2551  [SOIC-08]
D48  TS4148 RYG  DIODE0805  [0805_D]
D49  TS4148 RYG  DIODE0805  [0805_D]
D50  TS4148 RYG  DIODE0805  [0805_D]
D51  TS4148 RYG  DIODE0805  [0805_D]
D52  TS4148 RYG  DIODE0805  [0805_D]
D53  TS4148 RYG  DIODE0805  [0805_D]
D54  TS4148 RYG  DIODE0805  [0805_D]
D55  TS4148 RYG  DIODE0805  [0805_D]
R135  43k  RESISTOR0603  [0603-RES]
R136  12k  RESISTOR0603  [0603-RES]
R137  43k  RESISTOR0603  [0603-RES]
R138  12k  RESISTOR0603  [0603-RES]
R139  43k  RESISTOR0603  [0603-RES]
R140  12k  RESISTOR0603  [0603-RES]
R141  43k  RESISTOR0603  [0603-RES]
R142  12k  RESISTOR0603  [0603-RES]
R143  43k  RESISTOR0603  [0603-RES]
R144  12k  RESISTOR0603  [0603-RES]
R145  43k  RESISTOR0603  [0603-RES]
R146  12k  RESISTOR0603  [0603-RES]
R147  43k  RESISTOR0603  [0603-RES]
R148  12k  RESISTOR0603  [0603-RES]
R149  43k  RESISTOR0603  [0603-RES]
R150  12k  RESISTOR0603  [0603-RES]
U$48  TEENSY_3.2_SIMPLE  [TEENSY_3.2_SIMPLE]
U$52  TXB0106  [TSSOP-16]
U$53  MCP3208SOIC  [SOIC-16]
U$54  MCP23S17SSOP28  [SSOP28]
U$56  MCP6002SOIC  [SOIC-08]
U$57  MAX7480  [SOIC-08]
U$58  MCP6002SOIC  [SOIC-08]
U$60  MAX7480  [SOIC-08]
U$61  MAX7480  [SOIC-08]

### Nets
3V_MAIN_TEENSY: U$48.3.3V U$52.8(OE)
12VSUPPLY_DIV: C81.1 U$58.3(VINA+) ; also sheet 1
12VSUPPLY_READ: U$53.4(CH3) U$58.1(VOUTA) U$58.2(VINA-)
+3V3: C71.2 U$52.2(VCCA) ; also sheet 1,3
+5V: ACC1_PU1.2 ACC2_PU1.2 BRAKE_PU1.2 C62.2 C63.2 C64.2 C72.2 C73.2 C74.1 C76.1 C78.1 C79.1 C86.1 C87.1 C90.1 C92.1 CAN3.3 U$48.VIN U$52.15(VCCB) U$53.15(VREF) U$53.16(VDD) U$54.9(VDD) U$54.18(!RESET) U$56.8(VDD) U$57.4(VDD) U$57.7(!SHDN) U$58.8(VDD) U$60.4(VDD) U$60.7(!SHDN) U$61.4(VDD) U$61.7(!SHDN) ; also sheet 1,2,3
ACCEL1_BUFF: U$56.6(VINB-) U$56.7(VOUTB) U$57.2(IN)
ACCEL2_BUFF: U$56.1(VOUTA) U$56.2(VINA-) U$60.2(IN)
AGND: ACC1_PD1.2 ACC2_PD1.2 C72.1 C73.1 C75.2 C76.2 C77.1 C80.2 C86.2 C87.2 C89.2 C90.2 C91.1 C92.2 C93.1 U$53.9(DGND) U$53.14(AGND) U$56.4(VSS) U$57.3(GND) U$60.3(GND) U$61.3(GND) ; also sheet 1,3
BMS_OK: D49.A ; also sheet 1,2
BMS_OK_READ: R137.2 R138.1 U$48.A5
BRAKE_BUFF: U$58.6(VINB-) U$58.7(VOUTB) U$61.2(IN)
BRAKE_LIGHT_CTRL: U$48.D7(RX3) ; also sheet 1
BSPD_OK: D55.A ; also sheet 2
BSPD_OK_READ: R149.2 R150.1 U$48.A7
CANH: CAN3.7 ; also sheet 1,3
CANL: CAN3.6 ; also sheet 1,3
CS1_5V: U$52.14(B2) U$53.10(!CS!/SHDN)
CS1_TEENSY: U$48.D9(RX2) U$52.3(A2)
CS2_5V: U$52.13(B3) U$54.11(!CS)
CS2_TEENSY: U$48.D10(TX2) U$52.4(A3)
DASH11_READ: R141.2 R142.1 U$48.A0
DASH12_READ: R143.2 R144.1 U$48.A1
DASH_1_INTER: U$54.1(GPB0) ; also sheet 1
DASH_2_INTER: U$54.2(GPB1) ; also sheet 1
DASH_3_INTER: U$54.3(GPB2) ; also sheet 1
DASH_4_INTER: U$54.4(GPB3) ; also sheet 1
DASH_5_INTER: U$54.5(GPB4) ; also sheet 1
DASH_6_INTER: U$54.6(GPB5) ; also sheet 1
DASH_7_EXTERN: U$54.7(GPB6) ; also sheet 1
DASH_8_EXTERN: U$54.8(GPB7) ; also sheet 1
DASH_9_EXTERN: U$54.21(GPA0) ; also sheet 1
DASH_10_EXTERN: U$54.22(GPA1) ; also sheet 1
DASH_11_EXTERN: D51.A ; also sheet 1
DASH_12_EXTERN: D52.A ; also sheet 1
FAN1CONTROL: U$48.A8 ; also sheet 1
FAN2CONTROL: U$48.A9 ; also sheet 1
GND: C62.1 C63.1 C64.1 C71.1 C74.2 C78.2 C79.2 C81.2 CAN3.2 CAN3.8 R136.2 R138.2 R140.2 R142.2 R144.2 R146.2 R148.2 R150.2 U$48.GND U$52.9(GND) U$54.10(VSS) U$54.15(A0) U$54.16(A1) U$54.17(A2) U$58.4(VSS) ; also sheet 1,2,3
INVERTER_CTRL: U$48.D6 ; also sheet 1
MISO_5V: U$52.11(B5) U$53.12(DOUT) U$54.14(SO)
MISO_TEENSY: U$48.D12 U$52.6(A5)
MOSI_5V: U$52.12(B4) U$53.11(DIN) U$54.13(SI)
MOSI_TEENSY: U$48.D11 U$52.5(A4)
N$135: D48.C R135.1
N$137: D49.C R137.1
N$138: D50.C R139.1
N$144: D51.C R141.1
N$145: D52.C R143.1
N$146: D53.C R145.1
N$147: D54.C R147.1
N$150: D55.C R149.1
N$153: C75.1 U$57.8(CLK)
N$154: C89.1 U$60.8(CLK)
N$156: C77.2 U$57.1(COM) U$57.6(OS)
N$157: C80.1 U$61.8(CLK)
N$158: C93.2 U$61.1(COM) U$61.6(OS)
N$163: C91.2 U$60.1(COM) U$60.6(OS)
OKHS: D48.A ; also sheet 1,2
OKHS_READ: R135.2 R136.1 U$48.A6
READ_ACCEL1: U$53.2(CH1) U$57.5(OUT)
READ_ACCEL2: U$53.3(CH2) U$60.5(OUT)
READ_BRAKE: U$53.1(CH0) U$61.5(OUT)
RX_MAIN: CAN3.4 U$48.D4(CANRX)
SCK_5V: U$52.10(B6) U$53.13(CLK) U$54.12(SCK)
SCK_TEENSY: U$48.D13 U$52.7(A6)
SHUTDOWN_B: D53.A ; also sheet 2
SHUTDOWN_B_READ: R145.2 R146.1 U$48.A2
SHUTDOWN_C: D54.A ; also sheet 2
SHUTDOWN_C_READ: R147.2 R148.1 U$48.A3
SHUTDOWN_D: D50.A ; also sheet 1,2
SHUTDOWN_D_READ: R139.2 R140.1 U$48.A4
SIGNAL_ACCEL1: ACC1_PD1.1 ACC1_PU1.1 U$56.5(VINB+) ; also sheet 1
SIGNAL_ACCEL2: ACC2_PD1.1 ACC2_PU1.1 U$56.3(VINA+) ; also sheet 1
SIGNAL_BRAKE: BRAKE_PU1.1 U$58.5(VINB+) ; also sheet 1,2
TEMPSENSE: U$53.8(CH7) ; also sheet 3
TX_MAIN: CAN3.1 U$48.D3(CANTX)
Unconnected: CAN3.5 U$48.AGND U$48.D0(RX1) U$48.D1(TX1) U$48.D2 U$48.D5 U$48.D8(TX3) U$52.1(A1) U$52.16(B1) U$53.5(CH4) U$53.6(CH5) U$53.7(CH6) U$54.19(INTB) U$54.20(INTA) U$54.23(GPA2) U$54.24(GPA3) U$54.25(GPA4) U$54.26(GPA5) U$54.27(GPA6) U$54.28(GPA7)

### Notes on the sheet
- Pullup/down resistors to
  detect open circuit. Install
  only one per signal on
   ACCEL1 and ACCEL2.
- 470pF for ~1kHz filter (1.13kHz)
- 470pF for ~1kHz filter (1.13kHz)
- 470pF for ~1kHz filter (1.13kHz)
- Leonid Pozdneev
- Main microcontroller and analog signals circuitry.

## Library data of the parts
3V3_TEST C U$15 U$19 = HyTechDevices:TEST_POINT: Keystone Electronics Test Point 5005
5ABOARDFUSE1 5AFUSE1 5ASHUTDOWNFUSE1 = HyTechDevices:FUSE: Fuse/Fuseclips Keystone Electronics 3568 Fuse Mouser Part <http://www.mouser.com/ProductDetail/Keystone-Electronics/3568> Datasheet <http://www.mouser.com/ds/2/215/568-742601.pdf> Bussman/Eaton Midget Fuse Clip 1A3400 <http://www.mouser.com/ProductDetail/Bussmann-Eaton/BK-1A3400-09-R/?qs=sGAEpiMZZMuG%252bgnN5hGYGzzlAelq2OxnKqVSMVjq8I4%3d> Schurter 0751.0110 Brass Fuse Clip Datasheet <http://www.mouser.com/ds/2/358/typ_OG__Clip__5x20-2553.pdf>
ACC1_PD1 ACC1_PU1 ACC2_PD1 ACC2_PU1 BRAKE_PU1 R9 R24 R28 R64 R65 R73 R74 R83-R88 R91-R130 R133-R152 = HyTechDevices:RESISTOR: Resistor Basic schematic elements and footprints for 0603, 1206, and PTH resistors.
BOARD_TEMP = HyTechDevices:THERMISTOR_NCP21: Murata NCP Thermistor Datasheet <http://www.murata.com/~/media/webrenewal/support/library/catalog/products/thermistor/ntc/r44e.ashx>
C27-C29 C45 C48-C81 C86 C87 C89-C93 = HyTechDevices:CAP: Capacitor Standard 0603 ceramic capacitor, and 0.1" leaded capacitor.
CAL_BRAKE = HyTechDevices:TRIMPOT_3296: 3296 Series 3/8" Square Trimmer Source <https://github.com/chiengineer/Eagle-Libraries/blob/master/Potentiometers/bourns.lbr>
CAN2 CAN3 = HyTechDevices:MCP2551: MCP2551 High-Speed CAN Transceiver Product Webpage <https://www.microchip.com/wwwproducts/en/MCP2551> Datasheet <http://ww1.microchip.com/downloads/en/DeviceDoc/21667f.pdf> This device is outdated It is replaced by MCP2561. Comparison Page <https://www.microchip.com/wwwproducts/ProductCompare/MCP2551/MCP2561> Product Webpage <https://www.microchip.com/wwwproducts/en/MCP2561> Datasheet <http://ww1.microchip.com/downloads/en/DeviceDoc/20005167C.pdf>
CAN_TERM_JMP1 TEST_BRAKE TEST_CURRENT = HyTechDevices:M02: Standard 2-pin 0.1" header. NOTES ON THE VARIANTS LOCK and LOCK_LONGPADS... This footprint was designed to help hold the alignment of a through-hole component (i.e. 6-pin header) while soldering it into place. You may notice that each hole has been shifted either up or down by 0.005 of an inch from it's more standard position (which is a perfectly straight line). This slight alteration caused the pins (the squares in the middle) to touch the edges of the holes. Because they are alternating, it causes a "brace" to hold the component in place. 0.005 has proven to be the perfect amount of "off-center" position when using our standard breakaway headers. Although looks a little odd when you look at the bare footprint, once you have a header in there, the alteration is very hard to notice. Also,if you push a header all the way into place, it is covered up entirely on the bottom side. This idea of altering the position of holes to aid alignment will be further integrated into the Sparkfun Library for other footprints. It can help hold any component with 3 or more connection pins. Note: The Sparkfun version includes many other packages including surface mount that may be of future interest. Source: Sparkfun <https://github.com/sparkfun/SparkFun-Eagle-Libraries>
D8 D9 D29-D32 D39-D43 D45-D47 = HyTechDevices:DIODE_ZENER: ZENER DIODE
D33-D38 D44 D48-D55 = HyTechDevices:DIODE: DIODE general purpose rectifier
IMD_SHUTDOWN_RLY1 U$37 U$38 = HyTechDevices:RT424009: TE/Schrack Double Pull Double Throw Relay 9VDC Datasheet <https://www.mouser.com/datasheet/2/418/NG_DS_RT2_1014-736201.pdf> Product Page <https://www.te.com/usa-en/product-6-1393243-2.html>
INVERTER_PWR_RELAY1 = HyTechDevices:G5LE: Omron G5LE SPST Relay 5 VDC, 12VDC, 24VDC models Coil voltage: 75% - 170% of nominal voltage Datasheet <https://www.omron.com/ecb/products/pdf/en-g5le.pdf>
J15 J16 = HyTechDevices:JUMPER: Jumper for changing operation of a device
LED12 LED19 LED21-LED32 = HyTechDevices:LED: Light Emitting Diode (LED) Source: Dangerous Prototypes Eagle Library <https://github.com/DangerousPrototypes/Eagle_Part_Library>
MTK3339_BREAKOUT1 = HyTechDevices:M09: Standard 9-pin 0.1" header. Source: Sparkfun <https://github.com/sparkfun/SparkFun-Eagle-Libraries>
Q2 Q3 = HyTechDevices:P-CHANNEL_MOSFET_DMP3099L-7: Diodes Incorporated P-Channel Enhancement Mode MOSFET Datasheet <http://www.mouser.com/ds/2/115/DMP3099L-266220.pdf>
Q4 Q5 = HyTechDevices:DMG3406L: Generic NPN MOSFET DMG3406L (SOT-23, 2.8 A 30V)
REG1 = HyTechDevices:OKI-78SR-5: Murata OKI-78SR 5V 1.5A Non-Isolated Switching Regulator DC/DC - Datasheet <https://power.murata.com/data/power/oki-78sr.pdf>
REG3 = HyTechDevices:OKI-78SR-3.3: Murata OKI-78SR 5V 1.5A Non-Isolated Switching Regulator DC/DC - Datasheet <https://power.murata.com/data/power/oki-78sr.pdf>
S2 = HyTechDevices:BTN_10-XX: Small momentary tactile push button
U$4 U$7 = HyTechDevices:N-CHANNEL_MOSFET: Generic N-Channel MOSFET
U$5 = HyTechDevices:MC34152: Microchip MC34152 High Speed Dual MOSFET Driver
U$34 U$36 = HyTechDevices:TLP291-4: Toshiba Quad Channel Optocoupler TLP291-4 DC
U$39 = HyTechDevices:MCP6542: Microchip MCP6542 Dual Channel Push-Pull Comparator
U$40 = HyTechDevices:SN74AHC1G09: TI SN74AHC1G09 Single 2–Input Positive-AND Gate With Open-Drain Output Datasheet <http://www.ti.com/lit/ds/symlink/sn74ahc1g09.pdf>
U$41 = HyTechDevices:NE5532: TI NE5532 Dual Channel Op Amp
U$42 = HyTechDevices:CDSOT23-T24CAN-Q: CAN Bus dual TVS array for transceiver ESD and surge protection
U$43 = HyTechDevices:TEENSY_3.5_EXT: Simple version of the Teensy 3.5 board that only uses the 2 main rows of pins, plus the perpendicular row with VBat.
U$44 = HyTechDevices:XBEE: Source: Adafruit <https://github.com/adafruit/Adafruit-Eagle-Library>
U$45 = HyTechDevices:CR-2450/G1AN: Panasonic CR2450 Battery through hole.
U$46 U$56 U$58 = HyTechDevices:MCP6002: Microchip MCP6002 Dual Channel Op Amp
U$47 U$51 U$57 U$60 U$61 = HyTechDevices:MAX7480: 8th-order lowpass butterworth filter
U$48 = HyTechDevices:TEENSY_3.2_SIMPLE: Simple version of the Teensy 3.2 board that only uses the 2 main rows of pins, not the inner pins or the pins opposite the usb port.
U$49 U$50 = HyTechDevices:ACHS-7121
U$52 = HyTechDevices:TXB0106: Texas Instruments TXB0106 6-channel low voltage to high voltage Logic Level Shifter. Minimum input voltage level 1.8V. Maximum output voltage level 5.5V.
U$53 = HyTechDevices:MCP3208: Analog to Digital Converter
U$54 = HyTechDevices:MCP23S17
X5 = HyTechDevices:CONNECTOR-37: Mini-Fit Junior connector 12 pole Source: http://www.molex.com
X6 X7 = HyTechDevices:CONNECTOR-4: Mini-Fit Junior connector 4 pole Source: http://www.molex.com